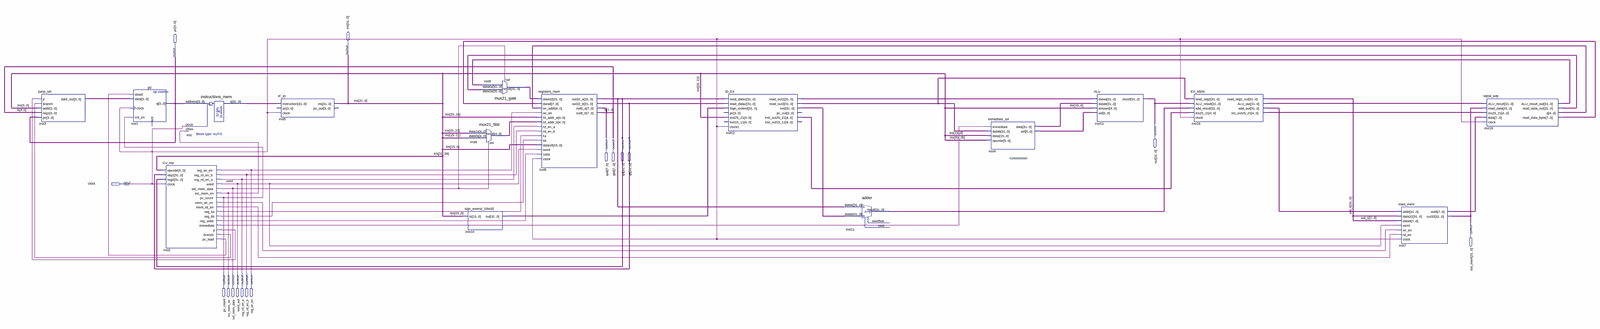
[diagram p0: schematic sheet, whole]
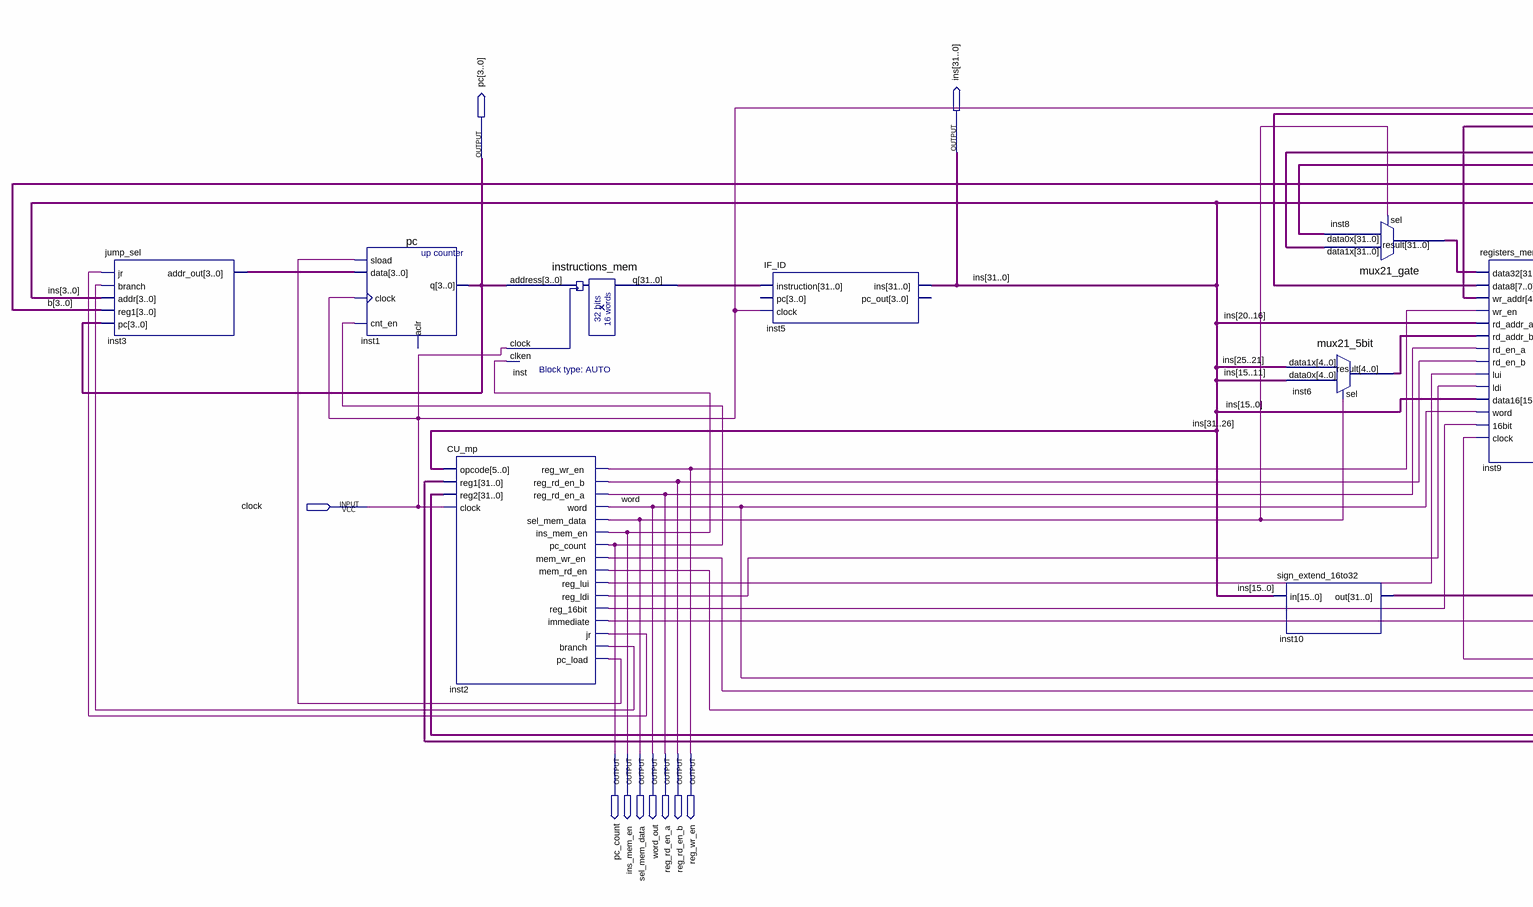
[diagram p1: schematic sheet, left part]
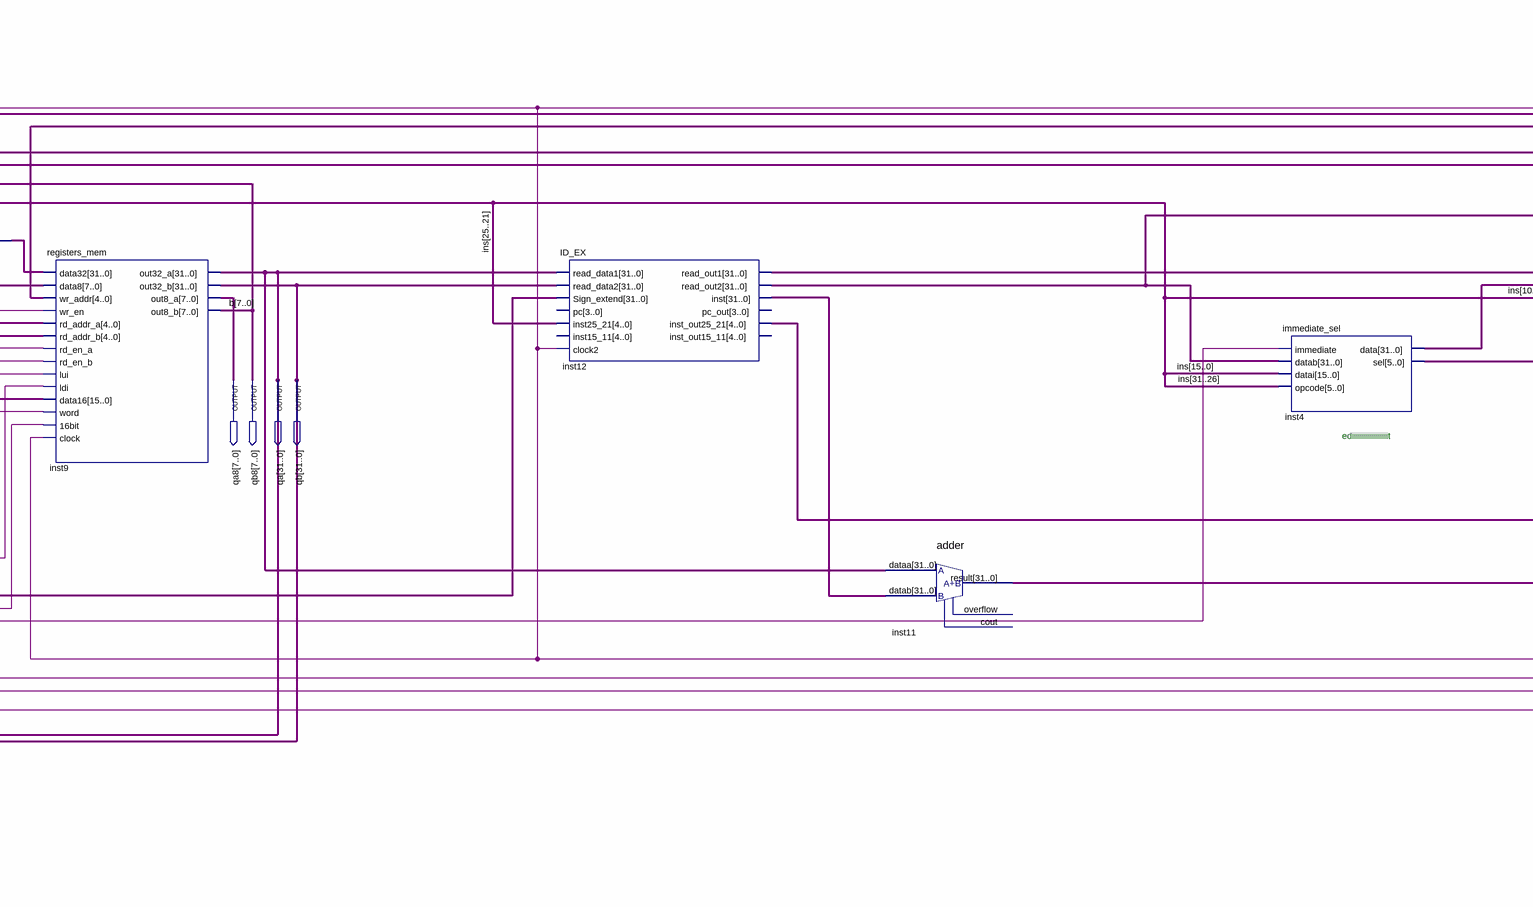
[diagram p2: schematic sheet, centre part]
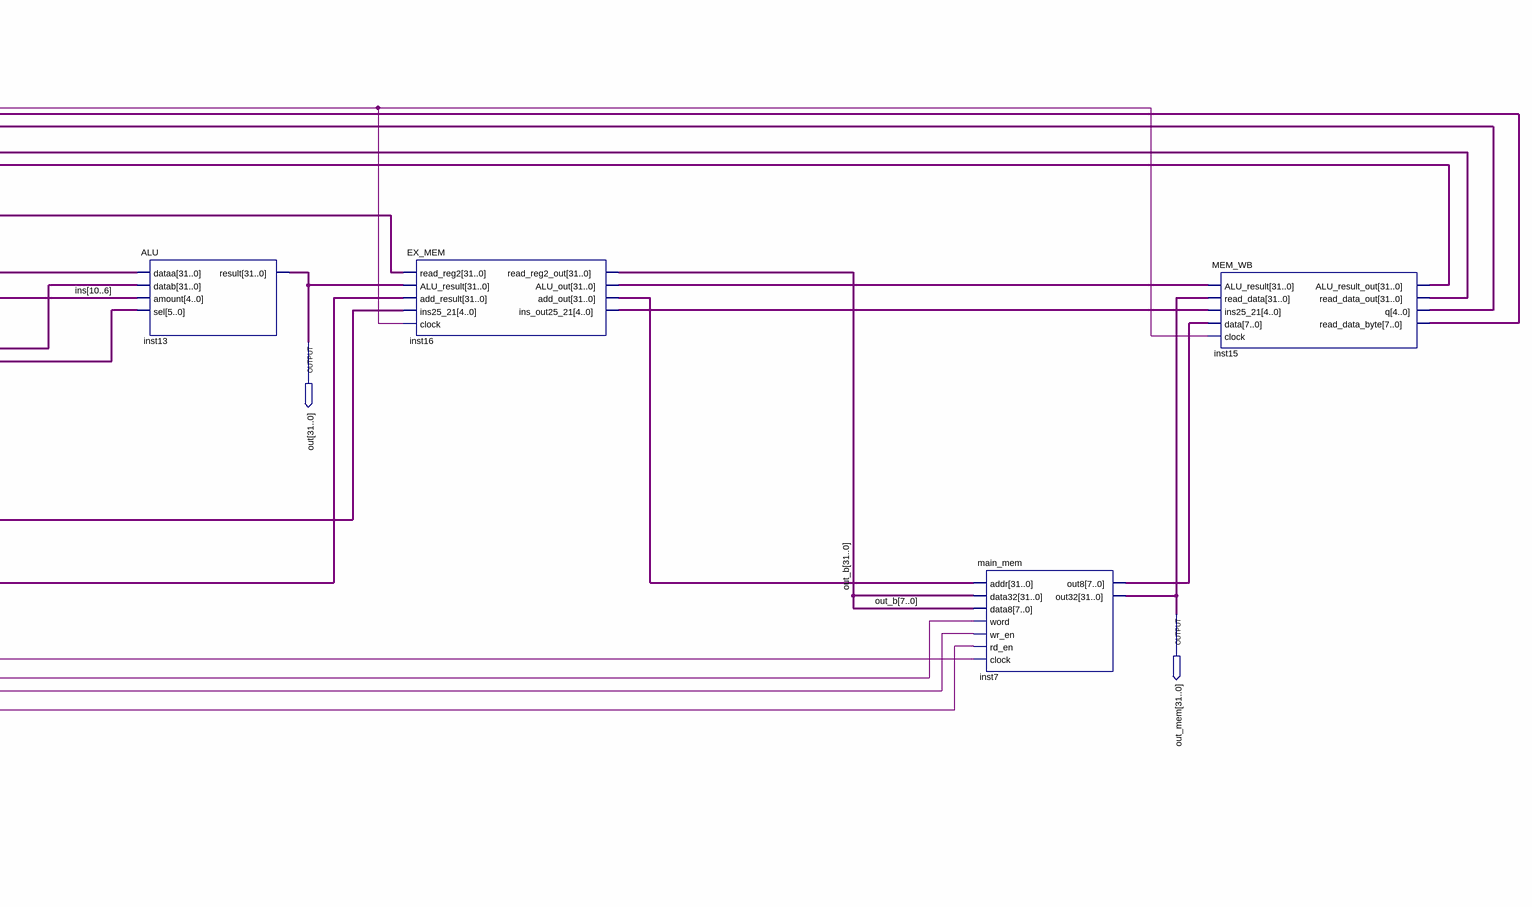
[diagram p3: schematic sheet, right part]
// Quartus schematic CPU.bdf as structural Verilog: 16 symbols, 16 pins
module CPU (
  input  clock,
  output [31:0] ins,
  output [3:0] pc,
  output [31:0] out,
  output [7:0] qa8,
  output [7:0] qb8,
  output [31:0] qa,
  output [31:0] qb,
  output [31:0] out_mem,
  output pc_count,
  output ins_mem_en,
  output sel_mem_data,
  output word_out,
  output reg_rd_en_a,
  output reg_rd_en_b,
  output reg_wr_en
);

  wire inst2_branch, inst2_immediate, inst2_jr, inst2_mem_rd_en, inst2_mem_wr_en, inst2_pc_load,
       inst2_reg_16bit, inst2_reg_ldi, inst2_reg_lui;
  wire [3:0] inst3_addr_out;
  wire [4:0] inst6_result, inst12_inst_out25_21, inst15_q, inst16_ins_out25_21;
  wire [5:0] inst4_sel;
  wire [7:0] inst7_out8, inst15_read_data_byte;
  wire [31:0] inst4_data, inst8_result, inst10_out, inst11_result, inst12_inst, inst12_read_out1,
       inst12_read_out2, inst15_alu_result_out, inst15_read_data_out, inst16_add_out, inst16_alu_out, inst_q,
       out_b;

  jump_sel inst3 (
    .jr(inst2_jr), .branch(inst2_branch), .addr(ins[3:0]), .reg1(qb8[3:0]), .pc(pc), .addr_out(inst3_addr_out));
  pc inst1 (.sload(inst2_pc_load), .data(inst3_addr_out), .clock(clock), .cnt_en(pc_count), .q(pc));  // open: aclr
  CU_mp inst2 (
    .opcode(ins[31:26]), .reg1(qb), .reg2(qa), .clock(clock), .reg_wr_en(reg_wr_en),
    .reg_rd_en_b(reg_rd_en_b), .reg_rd_en_a(reg_rd_en_a), .word(word_out), .sel_mem_data(sel_mem_data),
    .ins_mem_en(ins_mem_en), .pc_count(pc_count), .mem_wr_en(inst2_mem_wr_en), .mem_rd_en(inst2_mem_rd_en),
    .reg_lui(inst2_reg_lui), .reg_ldi(inst2_reg_ldi), .reg_16bit(inst2_reg_16bit),
    .immediate(inst2_immediate), .jr(inst2_jr), .branch(inst2_branch), .pc_load(inst2_pc_load));
  instructions_mem inst (.address(pc), .clock(clock), .clken(ins_mem_en), .q(inst_q));
  IF_ID inst5 (.instruction(inst_q), .clock(clock), .ins(ins));  // open: pc, pc_out
  mux21_5bit inst6 (.data1x(ins[25:21]), .data0x(ins[15:11]), .sel(sel_mem_data), .result(inst6_result));
  sign_extend_16to32 inst10 (.in(ins[15:0]), .out(inst10_out));
  mux21_gate inst8 (
    .data1x(inst15_read_data_out), .data0x(inst15_alu_result_out), .sel(sel_mem_data), .result(inst8_result));
  registers_mem inst9 (
    .data32(inst8_result), .data8(inst15_read_data_byte), .wr_addr(inst15_q), .wr_en(reg_wr_en),
    .rd_addr_a(ins[20:16]), .rd_addr_b(inst6_result), .rd_en_a(reg_rd_en_a), .rd_en_b(reg_rd_en_b),
    .lui(inst2_reg_lui), .ldi(inst2_reg_ldi), .data16(ins[15:0]), .word(word_out), .\16bit (inst2_reg_16bit),
    .clock(clock), .out32_a(qa), .out32_b(qb), .out8_a(qa8), .out8_b(qb8));
  ID_EX inst12 (
    .read_data1(qa), .read_data2(qb), .Sign_extend(inst10_out), .inst25_21(ins[25:21]), .clock2(clock),
    .read_out1(inst12_read_out1), .read_out2(inst12_read_out2), .inst(inst12_inst),
    .inst_out25_21(inst12_inst_out25_21));  // open: pc, inst15_11, pc_out, inst_out15_11
  adder inst11 (.dataa(qa), .datab(inst12_inst), .result(inst11_result));  // open: overflow, cout
  immediate_sel inst4 (
    .immediate(inst2_immediate), .datab(inst12_read_out2), .datai(ins[15:0]), .opcode(ins[31:26]),
    .data(inst4_data), .sel(inst4_sel));
  ALU inst13 (.dataa(inst12_read_out1), .datab(inst4_data), .amount(ins[10:6]), .sel(inst4_sel), .result(out));
  EX_MEM inst16 (
    .read_reg2(inst12_read_out2), .ALU_result(out), .add_result(inst11_result),
    .ins25_21(inst12_inst_out25_21), .clock(clock), .read_reg2_out(out_b), .ALU_out(inst16_alu_out),
    .add_out(inst16_add_out), .ins_out25_21(inst16_ins_out25_21));
  main_mem inst7 (
    .addr(inst16_add_out), .data32(out_b), .data8(out_b[7:0]), .word(word_out), .wr_en(inst2_mem_wr_en),
    .rd_en(inst2_mem_rd_en), .clock(clock), .out8(inst7_out8), .out32(out_mem));
  MEM_WB inst15 (
    .ALU_result(inst16_alu_out), .read_data(out_mem), .ins25_21(inst16_ins_out25_21), .data(inst7_out8),
    .clock(clock), .ALU_result_out(inst15_alu_result_out), .read_data_out(inst15_read_data_out),
    .q(inst15_q), .read_data_byte(inst15_read_data_byte));

  // Other names for the same wires on the sheet: b[7:0] = qb8; word = word_out

  // Notes on the sheet:
  //   ediiiiiiiiiiiiiiiiiit
endmodule
